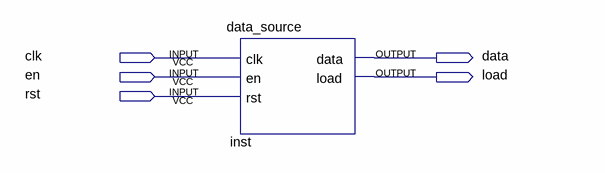
[diagram p0: schematic sheet]
// Quartus schematic Block3.bdf as structural Verilog: 1 symbols, 5 pins
module Block3 (
  input  clk,
  input  en,
  input  rst,
  output data,
  output load
);

  data_source inst (.clk(clk), .en(en), .rst(rst), .data(data), .load(load));
endmodule
